# Altium schematic sheet epd_driver.SchDoc
size 297 x 209 mm; DrawnBy: Supun; Engineer: Supun; Organization: C3
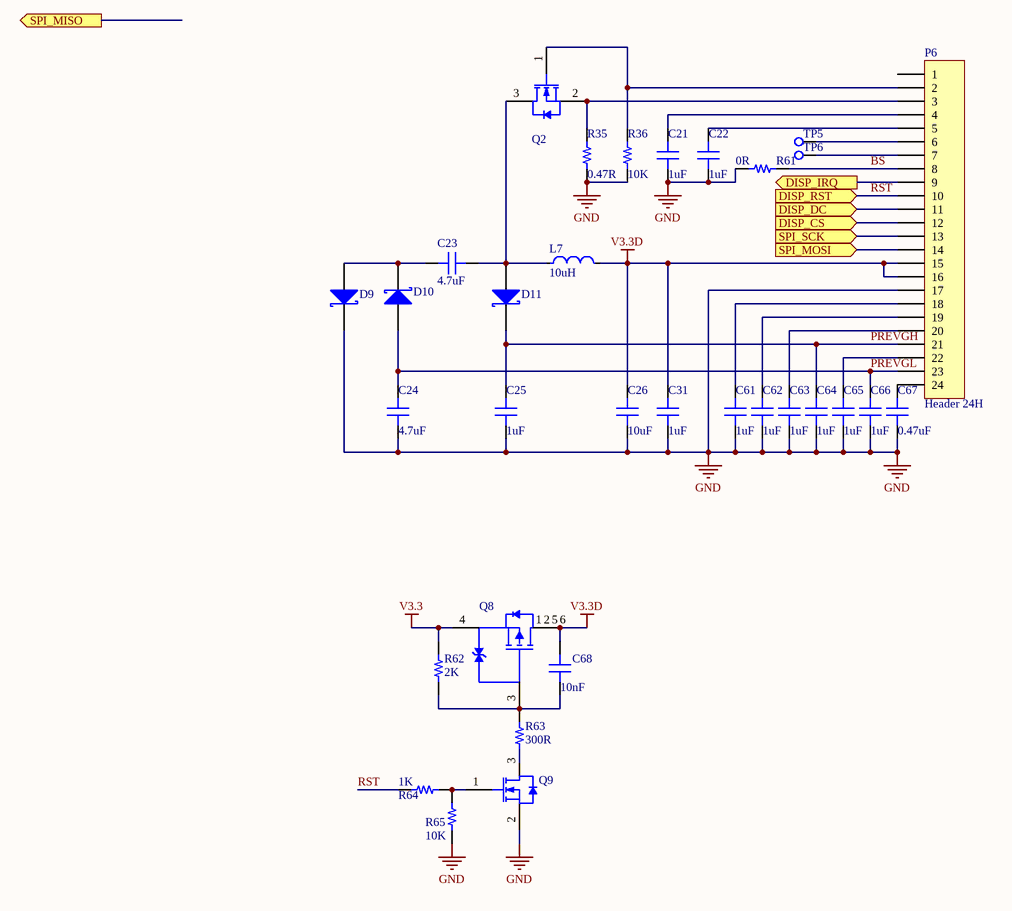
[diagram p0: epd_driver.SchDoc]

## Parts
C21  1uF  [CAP 0603_1608]
C22  1uF  [CAP 0603_1608]
C23  4.7uF  [CAP 0603_1608]
C24  4.7uF  [CAP 0603_1608]
C25  1uF  [CAP 0603_1608]
C26  10uF  [CAP 0603_1608]
C31  1uF  [CAP 0603_1608]
C61  1uF  [CAP 0603_1608]
C62  1uF  [CAP 0603_1608]
C63  1uF  [CAP 0603_1608]
C64  1uF  [CAP 0603_1608]
C65  1uF  [CAP 0603_1608]
C66  1uF  [CAP 0603_1608]
C67  0.47uF  [CAP 0603_1608]
C68  10nF  [CAP 0603_1608]
D9  *  [Rohm_TUMD2M_MFG]  (value not drawn)
D10  *  [Rohm_TUMD2M_MFG]  (value not drawn)
D11  *  [Rohm_TUMD2M_MFG]  (value not drawn)
L7  10uH  [IND 1008_2520]
P6  Header 24H  [Amphenol_FFC/FPC_24_0.5mm]
Q2  N Mosfet  [ON SEMI SOT-23-3]  (value not drawn)
Q8  P Mosfet  [Diodes_Inc._TSOT26_MFG]  (value not drawn)
Q9  N Mosfet  [ON SEMI SOT-23-3]  (value not drawn)
R35  0.47R  [RES 0603_1608]
R36  10K  [RES 0603_1608]
R61  0R  [RES 0603_1608]
R62  2K  [RES 0603_1608]
R63  300R  [RES 0603_1608]
R64  1K  [RES 0603_1608]
R65  10K  [RES 0603_1608]
TP5  Test Point  [TPSMD_S1]  (value not drawn)
TP6  Test Point  [TPSMD_S1]  (value not drawn)

## Ports
DISP_CS (in), DISP_DC (in), DISP_IRQ (out), DISP_RST (in), SPI_MISO (out), SPI_MOSI (in), SPI_SCK (in)

## Nets
GND: C21.1 C22.1 C24.2 C25.1 C26.2 C31.1 C61.1 C62.1 C63.1 C64.1 C65.1 C66.1 C67.1 D9.1(K) P6.17 Q9.2(S) R35.1 R36.2 R61.2 R65.1
V3.3: Q8.4(S) R62.1
V3.3D: C26.1 C31.2 C68.1 L7.2 P6.15 P6.16 Q8.1(D) Q8.2(D) Q8.5(D) Q8.6(D)
BS: P6.8 R61.1
DISP_CS: P6.12 ; port DISP_CS
DISP_DC: P6.11 ; port DISP_DC
DISP_IRQ: P6.9 ; port DISP_IRQ
PREVGH: C25.2 C64.2 D11.1(K) P6.21
PREVGL: C24.1 C66.2 D10.2(A) P6.23
RST: P6.10 R64.1 ; port DISP_RST
SPI_MOSI: P6.14 ; port SPI_MOSI
SPI_SCK: P6.13 ; port SPI_SCK
NetC21_2: C21.2 P6.4
NetC22_2: C22.2 P6.5
NetC23_1: C23.1 D9.2(A) D10.1(K)
NetC23_2: C23.2 D11.2(A) L7.1 Q2.3(D)
NetC61_2: C61.2 P6.18
NetC62_2: C62.2 P6.19
NetC63_2: C63.2 P6.20
NetC65_2: C65.2 P6.22
NetC67_2: C67.2 P6.24
NetC68_2: C68.2 Q8.3(G) R62.2 R63.2
NetP6_2: P6.2 Q2.1(G) R36.1
NetP6_3: P6.3 Q2.2(S) R35.2
NetP6_6: P6.6 TP5.1(TP)
NetP6_7: P6.7 TP6.1(TP)
NetQ9_1: Q9.1(G) R64.2 R65.2
NetQ9_3: Q9.3(D) R63.1

Not connected (* = marked no-connect by the designer): P6 1 25(GND) 26(GND)

## Notes on the sheet
- Title
- Size:
- Date:
- A4
- Number:
- Time:
- Revision:
- Sheet
- of
- File:

## Library data of the parts
C21 C22 C25 C31 C61-C66 = Capacitor: SMT Capacitor; MF: Murata; MP: GRT188R61H105KE13D; Value: 1uF; Link: https://www.mouser.com/ProductDetail/Murata-Electronics/GRT188R61H105KE13D?qs=drgMNd%252BkGPNIxxtJByMGCg%3D%3D
C23 C24 = Capacitor: SMT Capacitor; MF: Murata; MP: GRM188C81E475KE11J; Value: 4.7uF; Link: https://www.mouser.com/ProductDetail/Murata-Electronics/GRM188C81E475KE11J?qs=hNud%2FORuBR1v9UuS6Q2ZVQ%3D%3D
C26 = Capacitor: SMT Capacitor; MF: Murata; MP: GRM188R61C106MAALD; Value: 10uF; Link: https://www.mouser.com/ProductDetail/Murata-Electronics/GRM188R61C106MAALD?qs=hNud%2FORuBR3LEOKZ4RJp9w%3D%3D
C67 = Capacitor: SMT Capacitor; MF: Samsung; MP: CL10B474KA8NFNC; Value: 0.47uF; Link: https://www.mouser.com/ProductDetail/Samsung-Electro-Mechanics/CL10B474KA8NFNC?qs=MLItCLRbWszycm%2Fr6tUZRw%3D%3D
C68 = Capacitor: SMT Capacitor; MF: Murata; MP: GRM1885C1E103JA01D; Value: 10nF; Link: https://www.mouser.com/ProductDetail/Murata-Electronics/GRM1885C1E103JA01D?qs=ui%252B2d9lVEI4mHR%2FJ9wCzmw%3D%3D
D9-D11 = Schottky Diode: Schottky Barrier Rectifier, 40 V Maximum DC Blocking Voltage, -65 to 125 degC, 2-Pin SMA Case, RoHS; MF: Toshiba; MP: CUHS20F30,H3F; ComponentLink1Description: Manufacturer URL; ComponentLink2Description: Datasheet; ComponentLink3URL: http://www.vishay.com/docs/88746/ss12.pdf; ComponentLink3Description: Package Specification; ComponentLink1URL: http://www.vishay.com/; ComponentLink2URL: http://www.vishay.com/docs/88746/ss12.pdf; Value: *; Link: https://www.mouser.com/ProductDetail/Toshiba/CUHS20F30H3F?qs=PqoDHHvF6497%2FIoWy79A3w%3D%3D
L7 = Inductor_sm: Fixed Inductors 2.2uH 20% High Temp AEC-Q200; MF: Murata; MP: DFE252012F-100M=P2; Value: 10uH; Link: https://www.mouser.com/ProductDetail/Murata-Electronics/DFE252012F-100M%3dP2?qs=ty6qhqyUUEuRek9wjqhclw%3D%3D
P6 = Header 24H: Header, 24-Pin, Right Angle; MF: Amphenol; MP: 10051922-2410EHLF; Value: 24 FPC 0.5mm; LatestRevisionDate: 17-Jul-2002; LatestRevisionNote: Re-released for DXP Platform.; Publisher: Altium Limited
Q2 Q9 = Mosfet-N: N-Channel Enhancement Mode MOS Transistor, 30 V, 0.85 A, 3-Pin SOT23, Tape and Reel; Coss [typ] (pF): 27; Ciss [typ] (pF): 83; Packing: Tape & Reel; ID [max] (A): 0.85; VDS [max] (V): 30; MF: Diodes; MP: DMN2053U-7; ComponentLink1Description: Manufacturer URL; ComponentLink2Description: Datasheet; ComponentLink3Description: Package Specification; ComponentLink3URL: http://www.nxp.com/documents/outline_drawing/sot023_po.pdf; ComponentLink1URL: http://www.nxp.com/; ComponentLink2URL: http://www.nxp.com/documents/data_sheet/BSH103.pdf; PackageReference: SOT23; Channel Type: N; Code_JEDEC: TO-236AB; Mounting Technology: Surface Mount; PackageDescription: 3-Pin Small Outline Transistor Package, Body 2.9 x 1.3 mm, Pitch 0.95 mm; PackageVersion: 06-03-16, 03/2006; Value: N Mosfet; Link: https://www.mouser.com/ProductDetail/Diodes-Incorporated/DMN2053U-7?qs=y6ZabgHbY%252BwZqQYPRB57iA%3D%3D
Q8 = Mosfet-P-6_ESD: P-Channel Enhancement Mode MOS Transistor, 3-Pin SOT23; MF: Vishay; MP: SI3421DV-T1-GE3; Value: P Mosfet; Link: https://www.mouser.com/ProductDetail/Vishay-Semiconductors/SI3421DV-T1-GE3?qs=dpt6vIvaxwjvmZPXyyVpRg%3D%3D
R35 = Resistor: SMT Resistor; MF: Panasonic; MP: ERJ-3RQFR47V; Value: 0.47R; Link: https://www.mouser.com/ProductDetail/Panasonic/ERJ-3RQFR47V?qs=4WZYzuGhm5rszJHZ1WW1RA%3D%3D
R36 R65 = Resistor: SMT Resistor; MF: YAGEO; MP: AC0603FR-0710KL; Value: 10K; Link: https://www.mouser.com/ProductDetail/YAGEO/AC0603FR-0710KL?qs=UoPT7wUmgYKz3zh0UDMA4Q%3D%3D
R61 = Resistor: SMT Resistor; MF: YAGEO; MP: AC0603FR-070RL; Value: 0R; Link: https://www.mouser.com/ProductDetail/YAGEO/AC0603FR-070RL?qs=UoPT7wUmgYIHE8YhvUntLg%3D%3D
R62 = Resistor: SMT Resistor; MF: YAGEO; MP: AC0603FR-072KL; Value: 2K; Link: https://www.mouser.com/ProductDetail/YAGEO/AC0603FR-072KL?qs=ygRr%2FtkhtesLR2bjSRHyag%3D%3D
R63 = Resistor: SMT Resistor; MF: YAGEO; MP: AC0603FR-07300RL; Value: 300R; Link: https://www.mouser.com/ProductDetail/YAGEO/AC0603FR-07300RL?qs=yhV1fb9g%2FKYRCKndxB9juA%3D%3D
R64 = Resistor: SMT Resistor; MF: YAGEO; MP: AC0603FR-071KL; Value: 1K; Link: https://www.mouser.com/ProductDetail/YAGEO/AC0603FR-071KL?qs=UoPT7wUmgYJx4gI0q%252BcIRQ%3D%3D
TP5 TP6 = Test Point: Link: https://